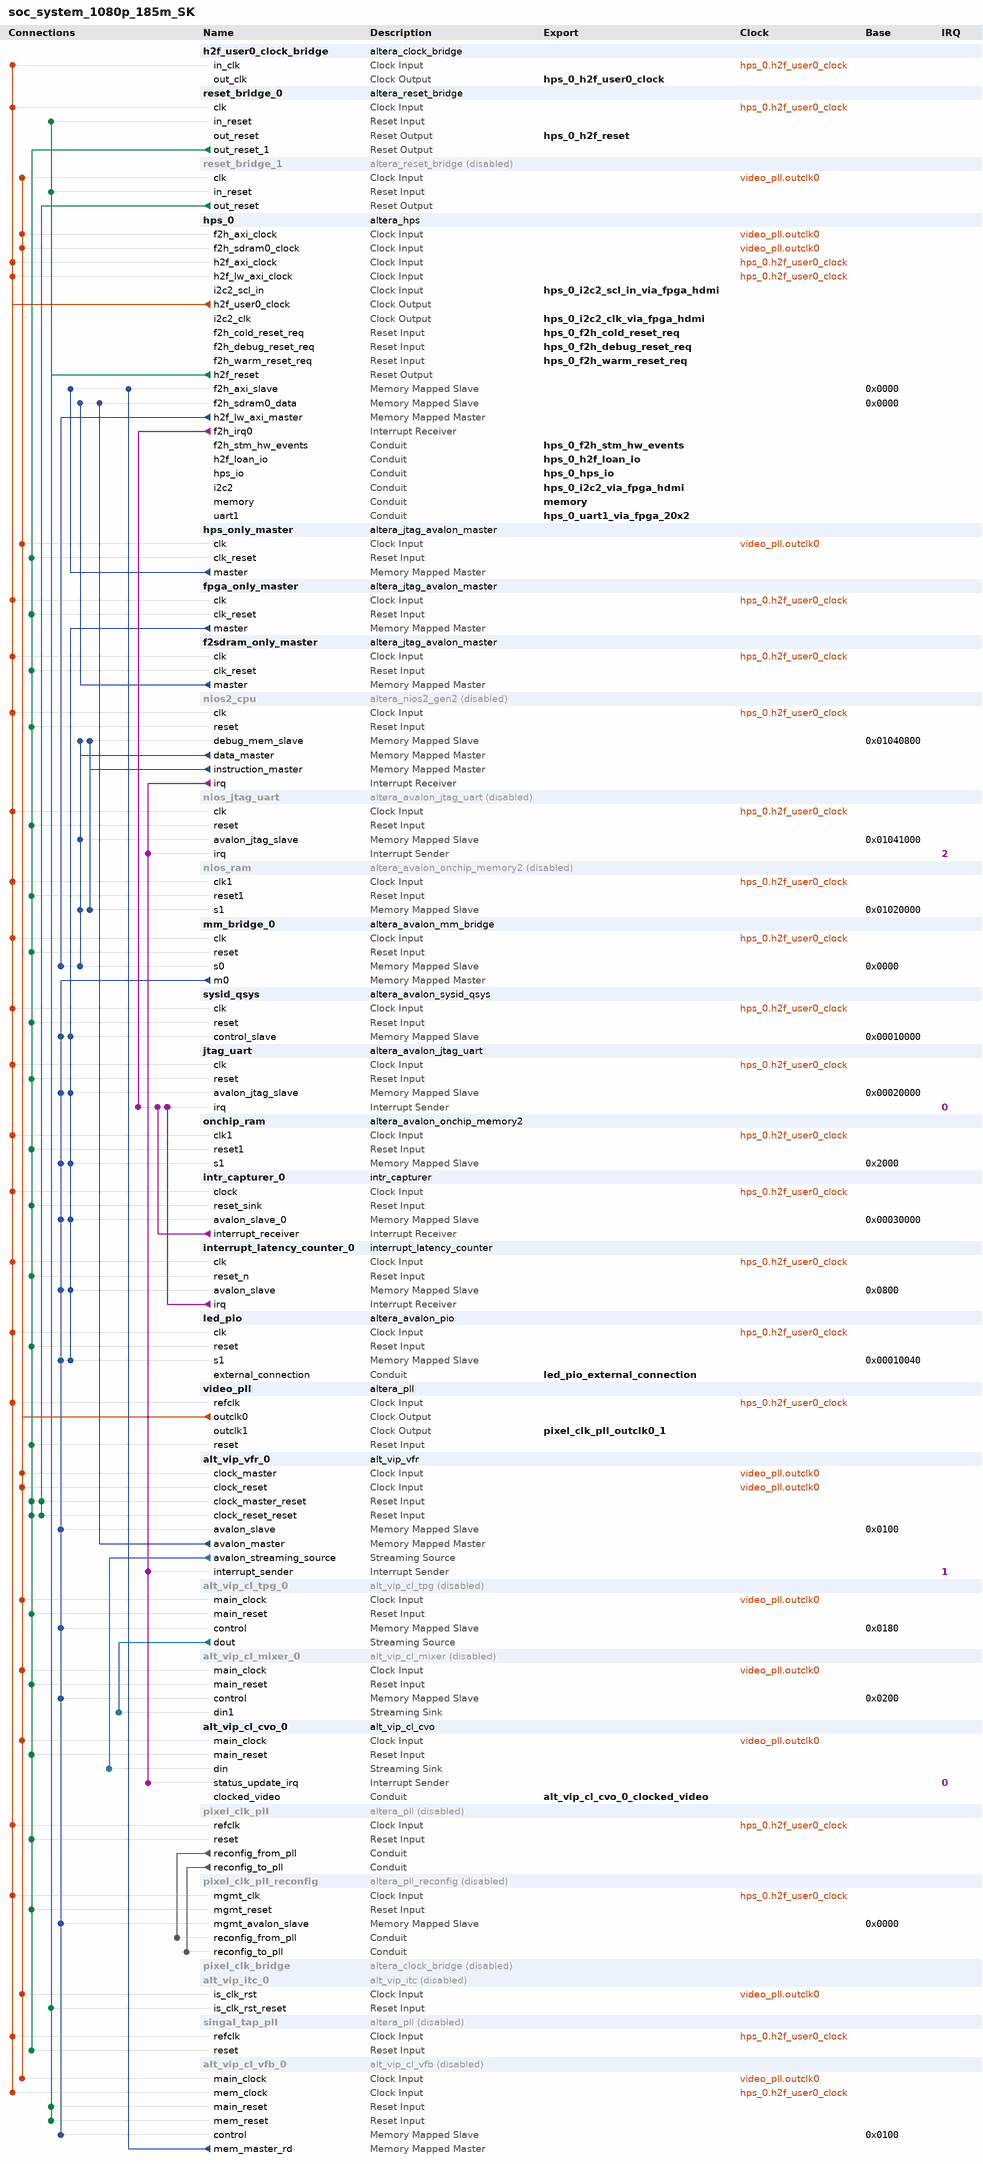
[diagram p0: system contents]
# Platform Designer (Qsys) system soc_system_1080p_185m_SK, Cyclone V 5CSEBA6U19I7
# Parameters at their usual value, and those the tool derives, are not listed.
package require -exact qsys 16.1
create_system soc_system_1080p_185m_SK
set_project_property DEVICE_FAMILY {Cyclone V}
set_project_property DEVICE 5CSEBA6U19I7

add_instance h2f_user0_clock_bridge altera_clock_bridge 16.1
set_instance_parameter_value h2f_user0_clock_bridge DERIVED_CLOCK_RATE 50000000
set_instance_parameter_value h2f_user0_clock_bridge EXPLICIT_CLOCK_RATE 0

add_instance reset_bridge_0 altera_reset_bridge 16.1
set_instance_parameter_value reset_bridge_0 ACTIVE_LOW_RESET 0
set_instance_parameter_value reset_bridge_0 NUM_RESET_OUTPUTS 2
set_instance_parameter_value reset_bridge_0 SYNCHRONOUS_EDGES deassert

add_instance reset_bridge_1 altera_reset_bridge 16.1
set_instance_property reset_bridge_1 ENABLED false
set_instance_parameter_value reset_bridge_1 ACTIVE_LOW_RESET 0
set_instance_parameter_value reset_bridge_1 SYNCHRONOUS_EDGES deassert

add_instance hps_0 altera_hps 16.1
set_instance_parameter_value hps_0 EMAC1_Mode N/A
set_instance_parameter_value hps_0 EMAC1_PinMuxing Unused
set_instance_parameter_value hps_0 F2SCLK_COLDRST_Enable true
set_instance_parameter_value hps_0 F2SCLK_DBGRST_Enable true
set_instance_parameter_value hps_0 F2SCLK_WARMRST_Enable true
set_instance_parameter_value hps_0 F2SDRAM_Type {Avalon-MM Bidirectional}
set_instance_parameter_value hps_0 F2SDRAM_Width 256
set_instance_parameter_value hps_0 F2SINTERRUPT_Enable true
set_instance_parameter_value hps_0 F2S_Width 2
set_instance_parameter_value hps_0 FPGA_PERIPHERAL_OUTPUT_CLOCK_FREQ_EMAC0_GTX_CLK 100
set_instance_parameter_value hps_0 FPGA_PERIPHERAL_OUTPUT_CLOCK_FREQ_EMAC0_MD_CLK 100.0
set_instance_parameter_value hps_0 FPGA_PERIPHERAL_OUTPUT_CLOCK_FREQ_EMAC1_GTX_CLK 100
set_instance_parameter_value hps_0 FPGA_PERIPHERAL_OUTPUT_CLOCK_FREQ_EMAC1_MD_CLK 100.0
set_instance_parameter_value hps_0 HPS_PROTOCOL DDR3
set_instance_parameter_value hps_0 I2C0_Mode I2C
set_instance_parameter_value hps_0 I2C0_PinMuxing {HPS I/O Set 0}
set_instance_parameter_value hps_0 I2C1_Mode I2C
set_instance_parameter_value hps_0 I2C1_PinMuxing {HPS I/O Set 0}
set_instance_parameter_value hps_0 I2C2_Mode Full
set_instance_parameter_value hps_0 I2C2_PinMuxing FPGA
set_instance_parameter_value hps_0 I2C3_Mode I2C
set_instance_parameter_value hps_0 I2C3_PinMuxing {HPS I/O Set 0}
set_instance_parameter_value hps_0 LWH2F_Enable true
set_instance_parameter_value hps_0 MEM_BANKADDR_WIDTH 3
set_instance_parameter_value hps_0 MEM_CLK_FREQ 300.0
set_instance_parameter_value hps_0 MEM_CLK_FREQ_MAX 666.667
set_instance_parameter_value hps_0 MEM_COL_ADDR_WIDTH 10
set_instance_parameter_value hps_0 MEM_DQ_WIDTH 16
set_instance_parameter_value hps_0 MEM_DRV_STR RZQ/7
set_instance_parameter_value hps_0 MEM_ROW_ADDR_WIDTH 14
set_instance_parameter_value hps_0 MEM_RTT_NOM RZQ/4
set_instance_parameter_value hps_0 MEM_RTT_WR RZQ/4
set_instance_parameter_value hps_0 MEM_TCL 6
set_instance_parameter_value hps_0 MEM_TFAW_NS 30.0
set_instance_parameter_value hps_0 MEM_TRAS_NS 36.0
set_instance_parameter_value hps_0 MEM_TRCD_NS 13.125
set_instance_parameter_value hps_0 MEM_TRFC_NS 160.0
set_instance_parameter_value hps_0 MEM_TRP_NS 13.125
set_instance_parameter_value hps_0 MEM_TRRD_NS 6.0
set_instance_parameter_value hps_0 MEM_VENDOR Other
set_instance_parameter_value hps_0 MEM_WTCL 5
set_instance_parameter_value hps_0 QSPI_Mode N/A
set_instance_parameter_value hps_0 QSPI_PinMuxing Unused
set_instance_parameter_value hps_0 REF_CLK_FREQ 25.0
set_instance_parameter_value hps_0 S2FCLK_USER0CLK_Enable true
set_instance_parameter_value hps_0 S2FCLK_USER2CLK 1
set_instance_parameter_value hps_0 S2F_Width 2
set_instance_parameter_value hps_0 SDIO_Mode {4-bit Data}
set_instance_parameter_value hps_0 SDIO_PinMuxing {HPS I/O Set 0}
set_instance_parameter_value hps_0 SPIM0_Mode {Single Slave Select}
set_instance_parameter_value hps_0 SPIM0_PinMuxing {HPS I/O Set 0}
set_instance_parameter_value hps_0 SPIM1_Mode {Single Slave Select}
set_instance_parameter_value hps_0 SPIM1_PinMuxing {HPS I/O Set 0}
set_instance_parameter_value hps_0 STM_Enable true
set_instance_parameter_value hps_0 TIMING_BOARD_AC_SKEW 0.03
set_instance_parameter_value hps_0 TIMING_BOARD_AC_TO_CK_SKEW 0.0
set_instance_parameter_value hps_0 TIMING_BOARD_DQ_TO_DQS_SKEW 0.0
set_instance_parameter_value hps_0 TIMING_BOARD_MAX_CK_DELAY 0.03
set_instance_parameter_value hps_0 TIMING_BOARD_MAX_DQS_DELAY 0.02
set_instance_parameter_value hps_0 TIMING_BOARD_SKEW_BETWEEN_DQS 0.08
set_instance_parameter_value hps_0 TIMING_BOARD_SKEW_CKDQS_DIMM_MAX 0.16
set_instance_parameter_value hps_0 TIMING_BOARD_SKEW_CKDQS_DIMM_MIN 0.09
set_instance_parameter_value hps_0 TIMING_BOARD_SKEW_WITHIN_DQS 0.01
set_instance_parameter_value hps_0 TIMING_TDH 65
set_instance_parameter_value hps_0 TIMING_TDQSCK 255
set_instance_parameter_value hps_0 TIMING_TDQSQ 125
set_instance_parameter_value hps_0 TIMING_TDS 30
set_instance_parameter_value hps_0 TIMING_TIH 140
set_instance_parameter_value hps_0 TIMING_TIS 180
set_instance_parameter_value hps_0 TIMING_TQSH 0.4
set_instance_parameter_value hps_0 UART0_Mode {No Flow Control}
set_instance_parameter_value hps_0 UART0_PinMuxing {HPS I/O Set 1}
set_instance_parameter_value hps_0 UART1_Mode Full
set_instance_parameter_value hps_0 UART1_PinMuxing FPGA
set_instance_parameter_value hps_0 USB1_Mode SDR
set_instance_parameter_value hps_0 USB1_PinMuxing {HPS I/O Set 0}
set_instance_parameter_value hps_0 desired_cfg_clk_mhz 50.0
set_instance_parameter_value hps_0 desired_qspi_clk_mhz 370.0

add_instance hps_only_master altera_jtag_avalon_master 16.1

add_instance fpga_only_master altera_jtag_avalon_master 16.1

add_instance f2sdram_only_master altera_jtag_avalon_master 16.1

add_instance nios2_cpu altera_nios2_gen2 16.1
set_instance_property nios2_cpu ENABLED false
set_instance_parameter_value nios2_cpu dcache_size 2048
set_instance_parameter_value nios2_cpu exceptionSlave nios_ram.s1
set_instance_parameter_value nios2_cpu icache_size 4096
set_instance_parameter_value nios2_cpu impl Tiny
set_instance_parameter_value nios2_cpu resetSlave nios_ram.s1

add_instance nios_jtag_uart altera_avalon_jtag_uart 16.1
set_instance_property nios_jtag_uart ENABLED false
set_instance_parameter_value nios_jtag_uart simInteractiveOptions NO_INTERACTIVE_WINDOWS

add_instance nios_ram altera_avalon_onchip_memory2 16.1
set_instance_property nios_ram ENABLED false
set_instance_parameter_value nios_ram dataWidth 32
set_instance_parameter_value nios_ram dualPort false
set_instance_parameter_value nios_ram initMemContent true
set_instance_parameter_value nios_ram initializationFileName onchip_mem.hex
set_instance_parameter_value nios_ram memorySize 131072

add_instance mm_bridge_0 altera_avalon_mm_bridge 16.1
set_instance_parameter_value mm_bridge_0 ADDRESS_UNITS SYMBOLS
set_instance_parameter_value mm_bridge_0 ADDRESS_WIDTH 10
set_instance_parameter_value mm_bridge_0 DATA_WIDTH 32
set_instance_parameter_value mm_bridge_0 MAX_PENDING_RESPONSES 4
set_instance_parameter_value mm_bridge_0 USE_AUTO_ADDRESS_WIDTH 1

add_instance sysid_qsys altera_avalon_sysid_qsys 16.1
set_instance_parameter_value sysid_qsys id 150

add_instance jtag_uart altera_avalon_jtag_uart 16.1
set_instance_parameter_value jtag_uart allowMultipleConnections true
set_instance_parameter_value jtag_uart simInteractiveOptions INTERACTIVE_ASCII_OUTPUT

add_instance onchip_ram altera_avalon_onchip_memory2 16.1
set_instance_parameter_value onchip_ram dataWidth 64
set_instance_parameter_value onchip_ram dualPort false
set_instance_parameter_value onchip_ram initMemContent true
set_instance_parameter_value onchip_ram initializationFileName onchip_memory2_0
set_instance_parameter_value onchip_ram memorySize 8192

add_instance intr_capturer_0 intr_capturer 100.99.98.97

add_instance interrupt_latency_counter_0 interrupt_latency_counter 16.1
set_instance_parameter_value interrupt_latency_counter_0 IRQ_PORT_CNT 8

add_instance led_pio altera_avalon_pio 16.1
set_instance_parameter_value led_pio direction Output
set_instance_parameter_value led_pio width 4

add_instance video_pll altera_pll 16.1
set_instance_parameter_value video_pll gui_device_speed_grade 2
set_instance_parameter_value video_pll gui_number_of_clocks 2
set_instance_parameter_value video_pll gui_operation_mode normal
set_instance_parameter_value video_pll gui_output_clock_frequency0 185.0
set_instance_parameter_value video_pll gui_output_clock_frequency1 148.5
set_instance_parameter_value video_pll gui_pll_mode {Fractional-N PLL}
set_instance_parameter_value video_pll gui_reference_clock_frequency 50.0
set_instance_parameter_value video_pll gui_use_locked false

add_instance alt_vip_vfr_0 alt_vip_vfr 14.0
set_instance_parameter_value alt_vip_vfr_0 MAX_IMAGE_HEIGHT 1080
set_instance_parameter_value alt_vip_vfr_0 MAX_IMAGE_WIDTH 1920

add_instance alt_vip_cl_tpg_0 alt_vip_cl_tpg 16.1
set_instance_property alt_vip_cl_tpg_0 ENABLED false
set_instance_parameter_value alt_vip_cl_tpg_0 BITS_PER_SYMBOL 8
set_instance_parameter_value alt_vip_cl_tpg_0 COLOR_PLANES_ARE_IN_PARALLEL 1
set_instance_parameter_value alt_vip_cl_tpg_0 COLOR_SPACE RGB
set_instance_parameter_value alt_vip_cl_tpg_0 FAMILY {Cyclone V}
set_instance_parameter_value alt_vip_cl_tpg_0 INTERLACING prog
set_instance_parameter_value alt_vip_cl_tpg_0 MAX_HEIGHT 1080
set_instance_parameter_value alt_vip_cl_tpg_0 MAX_WIDTH 1920
set_instance_parameter_value alt_vip_cl_tpg_0 NUMBER_OF_COLOR_PLANES 2
set_instance_parameter_value alt_vip_cl_tpg_0 OUTPUT_FORMAT 4.4.4
set_instance_parameter_value alt_vip_cl_tpg_0 PATTERN colorbars
set_instance_parameter_value alt_vip_cl_tpg_0 PIXELS_IN_PARALLEL 1
set_instance_parameter_value alt_vip_cl_tpg_0 RUNTIME_CONTROL 1
set_instance_parameter_value alt_vip_cl_tpg_0 UNIFORM_VALUE_BCR 16
set_instance_parameter_value alt_vip_cl_tpg_0 UNIFORM_VALUE_GCB 16
set_instance_parameter_value alt_vip_cl_tpg_0 UNIFORM_VALUE_RY 16

add_instance alt_vip_cl_mixer_0 alt_vip_cl_mixer 16.1
set_instance_property alt_vip_cl_mixer_0 ENABLED false
set_instance_parameter_value alt_vip_cl_mixer_0 ALPHA_ENABLE 1
set_instance_parameter_value alt_vip_cl_mixer_0 ALPHA_STREAMS_ENABLE 0
set_instance_parameter_value alt_vip_cl_mixer_0 BITS_PER_SYMBOL 8
set_instance_parameter_value alt_vip_cl_mixer_0 COLOR_PLANES_ARE_IN_PARALLEL 1
set_instance_parameter_value alt_vip_cl_mixer_0 COLOR_SPACE RGB
set_instance_parameter_value alt_vip_cl_mixer_0 FAMILY {Cyclone V}
set_instance_parameter_value alt_vip_cl_mixer_0 IS_422 1
set_instance_parameter_value alt_vip_cl_mixer_0 LAYER_POSITION_ENABLE 0
set_instance_parameter_value alt_vip_cl_mixer_0 MAX_HEIGHT 1080
set_instance_parameter_value alt_vip_cl_mixer_0 MAX_WIDTH 1920
set_instance_parameter_value alt_vip_cl_mixer_0 NO_OF_INPUTS 2
set_instance_parameter_value alt_vip_cl_mixer_0 NUMBER_OF_COLOR_PLANES 2
set_instance_parameter_value alt_vip_cl_mixer_0 PATTERN uniform
set_instance_parameter_value alt_vip_cl_mixer_0 PIPELINE_READY 1
set_instance_parameter_value alt_vip_cl_mixer_0 PIXELS_IN_PARALLEL 1
set_instance_parameter_value alt_vip_cl_mixer_0 UNIFORM_VALUE_BCR 0
set_instance_parameter_value alt_vip_cl_mixer_0 UNIFORM_VALUE_GCB 0
set_instance_parameter_value alt_vip_cl_mixer_0 UNIFORM_VALUE_RY 0
set_instance_parameter_value alt_vip_cl_mixer_0 USER_PACKET_FIFO_DEPTH 0
set_instance_parameter_value alt_vip_cl_mixer_0 USER_PACKET_SUPPORT DISCARD

add_instance alt_vip_cl_cvo_0 alt_vip_cl_cvo 16.1
set_instance_parameter_value alt_vip_cl_cvo_0 ACCEPT_COLOURS_IN_SEQ 0
set_instance_parameter_value alt_vip_cl_cvo_0 ANC_LINE 0
set_instance_parameter_value alt_vip_cl_cvo_0 AP_LINE 0
set_instance_parameter_value alt_vip_cl_cvo_0 BPS 8
set_instance_parameter_value alt_vip_cl_cvo_0 CLOCKS_ARE_SAME 0
set_instance_parameter_value alt_vip_cl_cvo_0 COLOUR_PLANES_ARE_IN_PARALLEL 1
set_instance_parameter_value alt_vip_cl_cvo_0 CONTEXT_WIDTH 8
set_instance_parameter_value alt_vip_cl_cvo_0 DST_WIDTH 8
set_instance_parameter_value alt_vip_cl_cvo_0 FIELD0_ANC_LINE 0
set_instance_parameter_value alt_vip_cl_cvo_0 FIELD0_V_BACK_PORCH 0
set_instance_parameter_value alt_vip_cl_cvo_0 FIELD0_V_BLANK 0
set_instance_parameter_value alt_vip_cl_cvo_0 FIELD0_V_FRONT_PORCH 0
set_instance_parameter_value alt_vip_cl_cvo_0 FIELD0_V_RISING_EDGE 0
set_instance_parameter_value alt_vip_cl_cvo_0 FIELD0_V_SYNC_LENGTH 0
set_instance_parameter_value alt_vip_cl_cvo_0 FIFO_DEPTH 1920
set_instance_parameter_value alt_vip_cl_cvo_0 F_FALLING_EDGE 0
set_instance_parameter_value alt_vip_cl_cvo_0 F_RISING_EDGE 0
set_instance_parameter_value alt_vip_cl_cvo_0 GENERATE_SYNC 0
set_instance_parameter_value alt_vip_cl_cvo_0 H_ACTIVE_PIXELS 1920
set_instance_parameter_value alt_vip_cl_cvo_0 H_BACK_PORCH 236
set_instance_parameter_value alt_vip_cl_cvo_0 H_BLANK 0
set_instance_parameter_value alt_vip_cl_cvo_0 H_FRONT_PORCH 0
set_instance_parameter_value alt_vip_cl_cvo_0 H_SYNC_LENGTH 44
set_instance_parameter_value alt_vip_cl_cvo_0 INTERLACED 0
set_instance_parameter_value alt_vip_cl_cvo_0 LOW_LATENCY 0
set_instance_parameter_value alt_vip_cl_cvo_0 NO_OF_CHANNELS 1
set_instance_parameter_value alt_vip_cl_cvo_0 NO_OF_MODES 1
set_instance_parameter_value alt_vip_cl_cvo_0 NUMBER_OF_COLOUR_PLANES 4
set_instance_parameter_value alt_vip_cl_cvo_0 PIXELS_IN_PARALLEL 1
set_instance_parameter_value alt_vip_cl_cvo_0 SRC_WIDTH 8
set_instance_parameter_value alt_vip_cl_cvo_0 STD_WIDTH 1
set_instance_parameter_value alt_vip_cl_cvo_0 TASK_WIDTH 8
set_instance_parameter_value alt_vip_cl_cvo_0 THRESHOLD 1919
set_instance_parameter_value alt_vip_cl_cvo_0 USE_CONTROL 0
set_instance_parameter_value alt_vip_cl_cvo_0 USE_EMBEDDED_SYNCS 0
set_instance_parameter_value alt_vip_cl_cvo_0 V_ACTIVE_LINES 1080
set_instance_parameter_value alt_vip_cl_cvo_0 V_BACK_PORCH 36
set_instance_parameter_value alt_vip_cl_cvo_0 V_BLANK 0
set_instance_parameter_value alt_vip_cl_cvo_0 V_FRONT_PORCH 4
set_instance_parameter_value alt_vip_cl_cvo_0 V_SYNC_LENGTH 5

add_instance pixel_clk_pll altera_pll 16.1
set_instance_property pixel_clk_pll ENABLED false
set_instance_parameter_value pixel_clk_pll gui_device_speed_grade 2
set_instance_parameter_value pixel_clk_pll gui_en_reconf true
set_instance_parameter_value pixel_clk_pll gui_number_of_clocks 1
set_instance_parameter_value pixel_clk_pll gui_operation_mode normal
set_instance_parameter_value pixel_clk_pll gui_output_clock_frequency0 148.5
set_instance_parameter_value pixel_clk_pll gui_pll_mode {Fractional-N PLL}
set_instance_parameter_value pixel_clk_pll gui_reference_clock_frequency 50.0
set_instance_parameter_value pixel_clk_pll gui_use_locked false

add_instance pixel_clk_pll_reconfig altera_pll_reconfig 16.1
set_instance_property pixel_clk_pll_reconfig ENABLED false

add_instance pixel_clk_bridge altera_clock_bridge 16.1
set_instance_property pixel_clk_bridge ENABLED false
set_instance_parameter_value pixel_clk_bridge DERIVED_CLOCK_RATE 0
set_instance_parameter_value pixel_clk_bridge EXPLICIT_CLOCK_RATE 0

add_instance alt_vip_itc_0 alt_vip_itc 14.0
set_instance_property alt_vip_itc_0 ENABLED false
set_instance_parameter_value alt_vip_itc_0 FIFO_DEPTH 1920
set_instance_parameter_value alt_vip_itc_0 H_ACTIVE_PIXELS 1920
set_instance_parameter_value alt_vip_itc_0 H_BACK_PORCH 148
set_instance_parameter_value alt_vip_itc_0 H_FRONT_PORCH 88
set_instance_parameter_value alt_vip_itc_0 H_SYNC_LENGTH 44
set_instance_parameter_value alt_vip_itc_0 NUMBER_OF_COLOUR_PLANES 4
set_instance_parameter_value alt_vip_itc_0 THRESHOLD 1919
set_instance_parameter_value alt_vip_itc_0 V_ACTIVE_LINES 1080
set_instance_parameter_value alt_vip_itc_0 V_BACK_PORCH 36
set_instance_parameter_value alt_vip_itc_0 V_FRONT_PORCH 4
set_instance_parameter_value alt_vip_itc_0 V_SYNC_LENGTH 5

add_instance singal_tap_pll altera_pll 16.1
set_instance_property singal_tap_pll ENABLED false
set_instance_parameter_value singal_tap_pll gui_device_speed_grade 2
set_instance_parameter_value singal_tap_pll gui_number_of_clocks 1
set_instance_parameter_value singal_tap_pll gui_operation_mode normal
set_instance_parameter_value singal_tap_pll gui_output_clock_frequency0 300.0
set_instance_parameter_value singal_tap_pll gui_pll_mode {Integer-N PLL}
set_instance_parameter_value singal_tap_pll gui_reference_clock_frequency 50.0
set_instance_parameter_value singal_tap_pll gui_use_locked false

add_instance alt_vip_cl_vfb_0 alt_vip_cl_vfb 16.1
set_instance_property alt_vip_cl_vfb_0 ENABLED false
set_instance_parameter_value alt_vip_cl_vfb_0 CLOCKS_ARE_SEPARATE 1
set_instance_parameter_value alt_vip_cl_vfb_0 DROP_FRAMES 0
set_instance_parameter_value alt_vip_cl_vfb_0 DROP_REPEAT_USER 0
set_instance_parameter_value alt_vip_cl_vfb_0 IS_FRAME_READER 1
set_instance_parameter_value alt_vip_cl_vfb_0 MAX_HEIGHT 1080
set_instance_parameter_value alt_vip_cl_vfb_0 MAX_WIDTH 1920
set_instance_parameter_value alt_vip_cl_vfb_0 MEM_BASE_ADDR 0
set_instance_parameter_value alt_vip_cl_vfb_0 MEM_BUFFER_OFFSET 16777216
set_instance_parameter_value alt_vip_cl_vfb_0 MEM_PORT_WIDTH 32
set_instance_parameter_value alt_vip_cl_vfb_0 NUMBER_OF_COLOR_PLANES 2
set_instance_parameter_value alt_vip_cl_vfb_0 READER_RUNTIME_CONTROL 1
set_instance_parameter_value alt_vip_cl_vfb_0 READ_FIFO_DEPTH 64
set_instance_parameter_value alt_vip_cl_vfb_0 REPEAT_FRAMES 0
set_instance_parameter_value alt_vip_cl_vfb_0 USER_PACKETS_MAX_STORAGE 0
set_instance_parameter_value alt_vip_cl_vfb_0 USE_BUFFER_OFFSET 0
set_instance_parameter_value alt_vip_cl_vfb_0 WRITE_BURST_TARGET 32
set_instance_parameter_value alt_vip_cl_vfb_0 WRITE_FIFO_DEPTH 64

# connections
add_connection hps_0.h2f_user0_clock alt_vip_cl_vfb_0.mem_clock clock
add_connection hps_0.h2f_user0_clock f2sdram_only_master.clk clock
add_connection hps_0.h2f_user0_clock fpga_only_master.clk clock
add_connection hps_0.h2f_user0_clock h2f_user0_clock_bridge.in_clk clock
add_connection hps_0.h2f_user0_clock hps_0.h2f_axi_clock clock
add_connection hps_0.h2f_user0_clock hps_0.h2f_lw_axi_clock clock
add_connection hps_0.h2f_user0_clock interrupt_latency_counter_0.clk clock
add_connection hps_0.h2f_user0_clock intr_capturer_0.clock clock
add_connection hps_0.h2f_user0_clock jtag_uart.clk clock
add_connection hps_0.h2f_user0_clock led_pio.clk clock
add_connection hps_0.h2f_user0_clock mm_bridge_0.clk clock
add_connection hps_0.h2f_user0_clock nios2_cpu.clk clock
add_connection hps_0.h2f_user0_clock nios_jtag_uart.clk clock
add_connection hps_0.h2f_user0_clock nios_ram.clk1 clock
add_connection hps_0.h2f_user0_clock onchip_ram.clk1 clock
add_connection hps_0.h2f_user0_clock pixel_clk_pll.refclk clock
add_connection hps_0.h2f_user0_clock pixel_clk_pll_reconfig.mgmt_clk clock
add_connection hps_0.h2f_user0_clock reset_bridge_0.clk clock
add_connection hps_0.h2f_user0_clock singal_tap_pll.refclk clock
add_connection hps_0.h2f_user0_clock sysid_qsys.clk clock
add_connection hps_0.h2f_user0_clock video_pll.refclk clock
add_connection video_pll.outclk0 alt_vip_cl_cvo_0.main_clock clock
add_connection video_pll.outclk0 alt_vip_cl_mixer_0.main_clock clock
add_connection video_pll.outclk0 alt_vip_cl_tpg_0.main_clock clock
add_connection video_pll.outclk0 alt_vip_cl_vfb_0.main_clock clock
add_connection video_pll.outclk0 alt_vip_itc_0.is_clk_rst clock
add_connection video_pll.outclk0 alt_vip_vfr_0.clock_master clock
add_connection video_pll.outclk0 alt_vip_vfr_0.clock_reset clock
add_connection video_pll.outclk0 hps_0.f2h_axi_clock clock
add_connection video_pll.outclk0 hps_0.f2h_sdram0_clock clock
add_connection video_pll.outclk0 hps_only_master.clk clock
add_connection video_pll.outclk0 reset_bridge_1.clk clock
add_connection hps_0.h2f_reset alt_vip_cl_vfb_0.main_reset reset
add_connection hps_0.h2f_reset alt_vip_cl_vfb_0.mem_reset reset
add_connection hps_0.h2f_reset alt_vip_itc_0.is_clk_rst_reset reset
add_connection hps_0.h2f_reset reset_bridge_0.in_reset reset
add_connection hps_0.h2f_reset reset_bridge_1.in_reset reset
add_connection reset_bridge_0.out_reset_1 alt_vip_cl_cvo_0.main_reset reset
add_connection reset_bridge_0.out_reset_1 alt_vip_cl_mixer_0.main_reset reset
add_connection reset_bridge_0.out_reset_1 alt_vip_cl_tpg_0.main_reset reset
add_connection reset_bridge_0.out_reset_1 alt_vip_vfr_0.clock_master_reset reset
add_connection reset_bridge_0.out_reset_1 alt_vip_vfr_0.clock_reset_reset reset
add_connection reset_bridge_0.out_reset_1 f2sdram_only_master.clk_reset reset
add_connection reset_bridge_0.out_reset_1 fpga_only_master.clk_reset reset
add_connection reset_bridge_0.out_reset_1 hps_only_master.clk_reset reset
add_connection reset_bridge_0.out_reset_1 interrupt_latency_counter_0.reset_n reset
add_connection reset_bridge_0.out_reset_1 intr_capturer_0.reset_sink reset
add_connection reset_bridge_0.out_reset_1 jtag_uart.reset reset
add_connection reset_bridge_0.out_reset_1 led_pio.reset reset
add_connection reset_bridge_0.out_reset_1 mm_bridge_0.reset reset
add_connection reset_bridge_0.out_reset_1 nios2_cpu.reset reset
add_connection reset_bridge_0.out_reset_1 nios_jtag_uart.reset reset
add_connection reset_bridge_0.out_reset_1 nios_ram.reset1 reset
add_connection reset_bridge_0.out_reset_1 onchip_ram.reset1 reset
add_connection reset_bridge_0.out_reset_1 pixel_clk_pll.reset reset
add_connection reset_bridge_0.out_reset_1 pixel_clk_pll_reconfig.mgmt_reset reset
add_connection reset_bridge_0.out_reset_1 singal_tap_pll.reset reset
add_connection reset_bridge_0.out_reset_1 sysid_qsys.reset reset
add_connection reset_bridge_0.out_reset_1 video_pll.reset reset
add_connection reset_bridge_1.out_reset alt_vip_vfr_0.clock_master_reset reset
add_connection reset_bridge_1.out_reset alt_vip_vfr_0.clock_reset_reset reset
add_connection alt_vip_cl_vfb_0.mem_master_rd hps_0.f2h_axi_slave avalon
set_connection_parameter_value alt_vip_cl_vfb_0.mem_master_rd/hps_0.f2h_axi_slave baseAddress 0x0000
add_connection alt_vip_vfr_0.avalon_master hps_0.f2h_sdram0_data avalon
set_connection_parameter_value alt_vip_vfr_0.avalon_master/hps_0.f2h_sdram0_data baseAddress 0x0000
add_connection f2sdram_only_master.master hps_0.f2h_sdram0_data avalon
set_connection_parameter_value f2sdram_only_master.master/hps_0.f2h_sdram0_data baseAddress 0x0000
add_connection fpga_only_master.master interrupt_latency_counter_0.avalon_slave avalon
set_connection_parameter_value fpga_only_master.master/interrupt_latency_counter_0.avalon_slave baseAddress 0x0800
add_connection fpga_only_master.master intr_capturer_0.avalon_slave_0 avalon
set_connection_parameter_value fpga_only_master.master/intr_capturer_0.avalon_slave_0 baseAddress 0x00030000
add_connection fpga_only_master.master jtag_uart.avalon_jtag_slave avalon
set_connection_parameter_value fpga_only_master.master/jtag_uart.avalon_jtag_slave baseAddress 0x00020000
add_connection fpga_only_master.master led_pio.s1 avalon
set_connection_parameter_value fpga_only_master.master/led_pio.s1 baseAddress 0x00010040
add_connection fpga_only_master.master onchip_ram.s1 avalon
set_connection_parameter_value fpga_only_master.master/onchip_ram.s1 baseAddress 0x2000
add_connection fpga_only_master.master sysid_qsys.control_slave avalon
set_connection_parameter_value fpga_only_master.master/sysid_qsys.control_slave baseAddress 0x00010000
add_connection hps_0.h2f_lw_axi_master mm_bridge_0.s0 avalon
set_connection_parameter_value hps_0.h2f_lw_axi_master/mm_bridge_0.s0 baseAddress 0x0000
add_connection hps_only_master.master hps_0.f2h_axi_slave avalon
set_connection_parameter_value hps_only_master.master/hps_0.f2h_axi_slave baseAddress 0x0000
add_connection mm_bridge_0.m0 alt_vip_cl_mixer_0.control avalon
set_connection_parameter_value mm_bridge_0.m0/alt_vip_cl_mixer_0.control baseAddress 0x0200
add_connection mm_bridge_0.m0 alt_vip_cl_tpg_0.control avalon
set_connection_parameter_value mm_bridge_0.m0/alt_vip_cl_tpg_0.control baseAddress 0x0180
add_connection mm_bridge_0.m0 alt_vip_cl_vfb_0.control avalon
set_connection_parameter_value mm_bridge_0.m0/alt_vip_cl_vfb_0.control baseAddress 0x0100
add_connection mm_bridge_0.m0 alt_vip_vfr_0.avalon_slave avalon
set_connection_parameter_value mm_bridge_0.m0/alt_vip_vfr_0.avalon_slave baseAddress 0x0100
add_connection mm_bridge_0.m0 interrupt_latency_counter_0.avalon_slave avalon
set_connection_parameter_value mm_bridge_0.m0/interrupt_latency_counter_0.avalon_slave baseAddress 0x0800
add_connection mm_bridge_0.m0 intr_capturer_0.avalon_slave_0 avalon
set_connection_parameter_value mm_bridge_0.m0/intr_capturer_0.avalon_slave_0 baseAddress 0x00030000
add_connection mm_bridge_0.m0 jtag_uart.avalon_jtag_slave avalon
set_connection_parameter_value mm_bridge_0.m0/jtag_uart.avalon_jtag_slave baseAddress 0x00020000
add_connection mm_bridge_0.m0 led_pio.s1 avalon
set_connection_parameter_value mm_bridge_0.m0/led_pio.s1 baseAddress 0x00010040
add_connection mm_bridge_0.m0 onchip_ram.s1 avalon
set_connection_parameter_value mm_bridge_0.m0/onchip_ram.s1 baseAddress 0x2000
add_connection mm_bridge_0.m0 pixel_clk_pll_reconfig.mgmt_avalon_slave avalon
set_connection_parameter_value mm_bridge_0.m0/pixel_clk_pll_reconfig.mgmt_avalon_slave baseAddress 0x0000
add_connection mm_bridge_0.m0 sysid_qsys.control_slave avalon
set_connection_parameter_value mm_bridge_0.m0/sysid_qsys.control_slave baseAddress 0x00010000
add_connection nios2_cpu.data_master mm_bridge_0.s0 avalon
set_connection_parameter_value nios2_cpu.data_master/mm_bridge_0.s0 baseAddress 0x0000
add_connection nios2_cpu.data_master nios2_cpu.debug_mem_slave avalon
set_connection_parameter_value nios2_cpu.data_master/nios2_cpu.debug_mem_slave baseAddress 0x01040800
add_connection nios2_cpu.data_master nios_jtag_uart.avalon_jtag_slave avalon
set_connection_parameter_value nios2_cpu.data_master/nios_jtag_uart.avalon_jtag_slave baseAddress 0x01041000
add_connection nios2_cpu.data_master nios_ram.s1 avalon
set_connection_parameter_value nios2_cpu.data_master/nios_ram.s1 baseAddress 0x01020000
add_connection nios2_cpu.instruction_master nios2_cpu.debug_mem_slave avalon
set_connection_parameter_value nios2_cpu.instruction_master/nios2_cpu.debug_mem_slave baseAddress 0x01040800
add_connection nios2_cpu.instruction_master nios_ram.s1 avalon
set_connection_parameter_value nios2_cpu.instruction_master/nios_ram.s1 baseAddress 0x01020000
add_connection alt_vip_cl_tpg_0.dout alt_vip_cl_mixer_0.din1 avalon_streaming
add_connection alt_vip_vfr_0.avalon_streaming_source alt_vip_cl_cvo_0.din avalon_streaming
add_connection pixel_clk_pll.reconfig_from_pll pixel_clk_pll_reconfig.reconfig_from_pll conduit
add_connection pixel_clk_pll.reconfig_to_pll pixel_clk_pll_reconfig.reconfig_to_pll conduit
add_connection hps_0.f2h_irq0 jtag_uart.irq interrupt
set_connection_parameter_value hps_0.f2h_irq0/jtag_uart.irq irqNumber 0
add_connection interrupt_latency_counter_0.irq jtag_uart.irq interrupt
set_connection_parameter_value interrupt_latency_counter_0.irq/jtag_uart.irq irqNumber 0
add_connection intr_capturer_0.interrupt_receiver jtag_uart.irq interrupt
set_connection_parameter_value intr_capturer_0.interrupt_receiver/jtag_uart.irq irqNumber 0
add_connection nios2_cpu.irq alt_vip_cl_cvo_0.status_update_irq interrupt
set_connection_parameter_value nios2_cpu.irq/alt_vip_cl_cvo_0.status_update_irq irqNumber 0
add_connection nios2_cpu.irq alt_vip_vfr_0.interrupt_sender interrupt
set_connection_parameter_value nios2_cpu.irq/alt_vip_vfr_0.interrupt_sender irqNumber 1
add_connection nios2_cpu.irq nios_jtag_uart.irq interrupt
set_connection_parameter_value nios2_cpu.irq/nios_jtag_uart.irq irqNumber 2

# exported interfaces
add_interface alt_vip_cl_cvo_0_clocked_video conduit end
set_interface_property alt_vip_cl_cvo_0_clocked_video EXPORT_OF alt_vip_cl_cvo_0.clocked_video
add_interface hps_0_f2h_cold_reset_req reset sink
set_interface_property hps_0_f2h_cold_reset_req EXPORT_OF hps_0.f2h_cold_reset_req
add_interface hps_0_f2h_debug_reset_req reset sink
set_interface_property hps_0_f2h_debug_reset_req EXPORT_OF hps_0.f2h_debug_reset_req
add_interface hps_0_f2h_stm_hw_events conduit end
set_interface_property hps_0_f2h_stm_hw_events EXPORT_OF hps_0.f2h_stm_hw_events
add_interface hps_0_f2h_warm_reset_req reset sink
set_interface_property hps_0_f2h_warm_reset_req EXPORT_OF hps_0.f2h_warm_reset_req
add_interface hps_0_h2f_loan_io conduit end
set_interface_property hps_0_h2f_loan_io EXPORT_OF hps_0.h2f_loan_io
add_interface hps_0_h2f_reset reset source
set_interface_property hps_0_h2f_reset EXPORT_OF reset_bridge_0.out_reset
add_interface hps_0_h2f_user0_clock clock source
set_interface_property hps_0_h2f_user0_clock EXPORT_OF h2f_user0_clock_bridge.out_clk
add_interface hps_0_hps_io conduit end
set_interface_property hps_0_hps_io EXPORT_OF hps_0.hps_io
add_interface hps_0_i2c2_clk_via_fpga_hdmi clock source
set_interface_property hps_0_i2c2_clk_via_fpga_hdmi EXPORT_OF hps_0.i2c2_clk
add_interface hps_0_i2c2_scl_in_via_fpga_hdmi clock sink
set_interface_property hps_0_i2c2_scl_in_via_fpga_hdmi EXPORT_OF hps_0.i2c2_scl_in
add_interface hps_0_i2c2_via_fpga_hdmi conduit end
set_interface_property hps_0_i2c2_via_fpga_hdmi EXPORT_OF hps_0.i2c2
add_interface hps_0_uart1_via_fpga_20x2 conduit end
set_interface_property hps_0_uart1_via_fpga_20x2 EXPORT_OF hps_0.uart1
add_interface led_pio_external_connection conduit end
set_interface_property led_pio_external_connection EXPORT_OF led_pio.external_connection
add_interface memory conduit end
set_interface_property memory EXPORT_OF hps_0.memory
add_interface pixel_clk_pll_outclk0_1 clock source
set_interface_property pixel_clk_pll_outclk0_1 EXPORT_OF video_pll.outclk1

set_interconnect_requirement {$system} qsys_mm.clockCrossingAdapter AUTO
set_interconnect_requirement {$system} qsys_mm.insertDefaultSlave FALSE
set_interconnect_requirement {$system} qsys_mm.maxAdditionalLatency 3
set_interconnect_requirement hps_only_master.master qsys_mm.security SECURE

save_system soc_system_1080p_185m_SK.qsys
